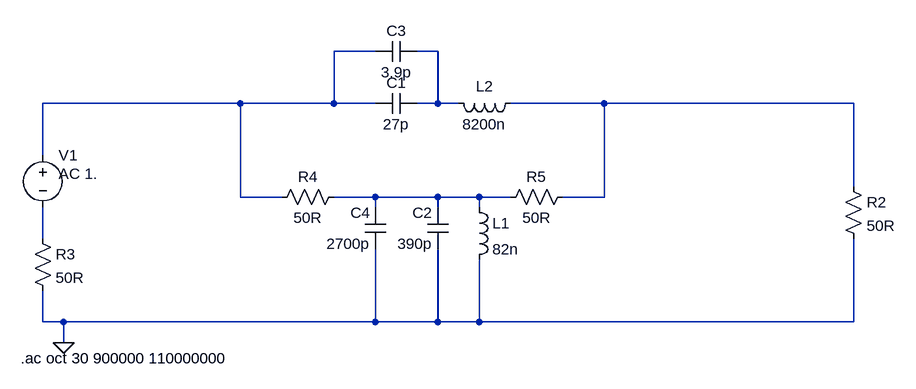
[diagram p0: schematic 10MhzDiplexer.asc]
10MhzDiplexer.asc, the LTspice schematic file:
Version 4
SHEET 1 880 680
WIRE -144 -224 -208 -224
WIRE -48 -224 -80 -224
WIRE -352 -144 -656 -144
WIRE -208 -144 -208 -224
WIRE -208 -144 -352 -144
WIRE -144 -144 -208 -144
WIRE -48 -144 -48 -224
WIRE -48 -144 -80 -144
WIRE -16 -144 -48 -144
WIRE 208 -144 64 -144
WIRE 592 -144 208 -144
WIRE -656 -64 -656 -144
WIRE 592 -16 592 -144
WIRE -352 0 -352 -144
WIRE -288 0 -352 0
WIRE -144 0 -208 0
WIRE -48 0 -144 0
WIRE 16 0 -48 0
WIRE 64 0 16 0
WIRE 208 0 208 -144
WIRE 208 0 144 0
WIRE -144 16 -144 0
WIRE -48 16 -48 0
WIRE 16 16 16 0
WIRE -656 64 -656 16
WIRE -656 192 -656 144
WIRE -624 192 -656 192
WIRE -144 192 -144 80
WIRE -144 192 -624 192
WIRE -48 192 -48 80
WIRE -48 192 -144 192
WIRE 16 192 16 96
WIRE 16 192 -48 192
WIRE 592 192 592 64
WIRE 592 192 16 192
WIRE -624 224 -624 192
FLAG -624 224 0
SYMBOL cap -80 -160 R90
WINDOW 0 0 32 VBottom 2
WINDOW 3 32 32 VTop 2
SYMATTR InstName C1
SYMATTR Value 27p
SYMBOL cap -32 80 R180
WINDOW 0 24 56 Left 2
WINDOW 3 24 8 Left 2
SYMATTR InstName C2
SYMATTR Value 390p
SYMBOL ind 0 0 R0
SYMATTR InstName L1
SYMATTR Value 82n
SYMBOL voltage -656 -80 R0
WINDOW 123 24 44 Left 2
WINDOW 39 0 0 Left 0
SYMATTR InstName V1
SYMATTR Value ""
SYMATTR Value2 AC 1.
SYMBOL ind 80 -160 R90
WINDOW 0 5 56 VBottom 2
WINDOW 3 32 56 VTop 2
SYMATTR InstName L2
SYMATTR Value 8200n
SYMBOL res -672 48 R0
SYMATTR InstName R3
SYMATTR Value 50R
SYMBOL res 576 -32 R0
SYMATTR InstName R2
SYMATTR Value 50R
SYMBOL res -192 -16 R90
WINDOW 0 0 56 VBottom 2
WINDOW 3 32 56 VTop 2
SYMATTR InstName R4
SYMATTR Value 50R
SYMBOL res 160 -16 R90
WINDOW 0 0 56 VBottom 2
WINDOW 3 32 56 VTop 2
SYMATTR InstName R5
SYMATTR Value 50R
SYMBOL cap -80 -240 R90
WINDOW 0 0 32 VBottom 2
WINDOW 3 32 32 VTop 2
SYMATTR InstName C3
SYMATTR Value 3.9p
SYMBOL cap -128 80 R180
WINDOW 0 24 56 Left 2
WINDOW 3 24 8 Left 2
SYMATTR InstName C4
SYMATTR Value 2700p
TEXT -690 248 Left 2 !.ac oct 30 900000 110000000

The netlist it stands for:
* 10MhzDiplexer.asc
C1 N002 N001 27p
C2 0 N004 390p
L1 N004 0 82n
V1 N001 N005 AC 1.
L2 N003 N002 8200n
R3 N005 0 50R
R2 N003 0 50R
R4 N004 N001 50R
R5 N003 N004 50R
C3 N002 N001 3.9p
C4 0 N004 2700p
.ac oct 30 900000 110000000
.backanno
.end